# Altium schematic sheet ESP32.SchDoc
size A4; SheetNumber: 1; SheetTotal: 3
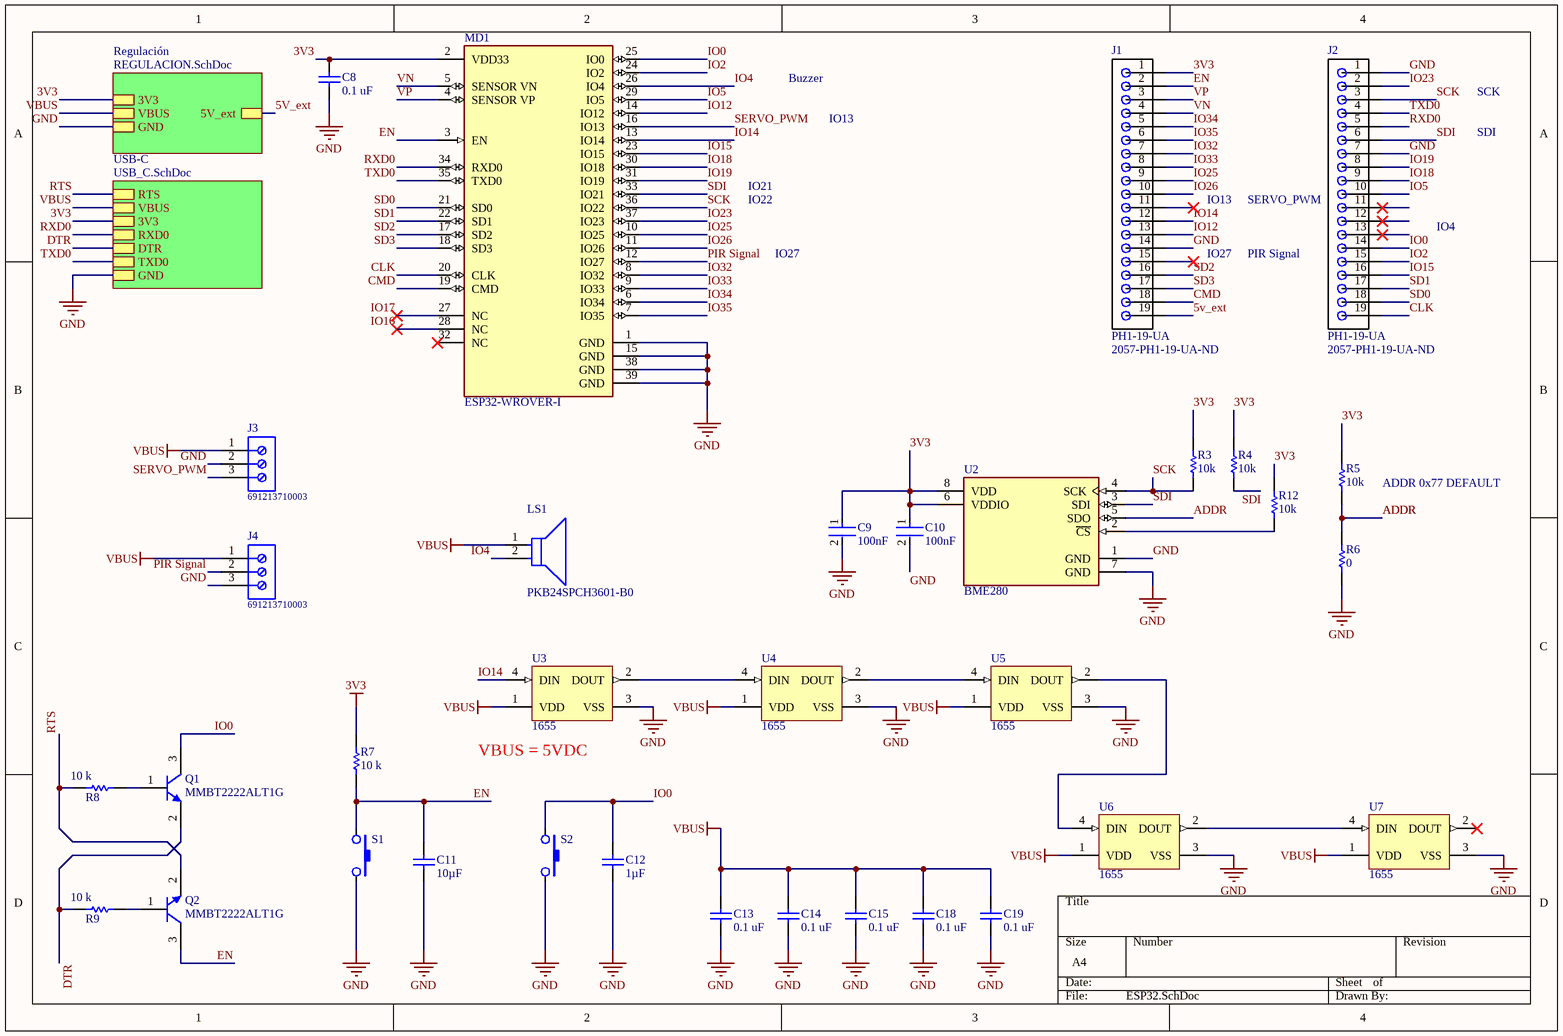
[diagram p0: ESP32.SchDoc]

## Parts
C8  0.1 uF  [CAPC2013X94X50ML20T25]
C9  100nF  [FP-C0805C-DN-MFG]
C10  100nF  [FP-C0805C-DN-MFG]
C11  10µF  [CAPC2013X145X50ML20T25]
C12  1µF  [CAPC2013X145X50ML20T25]
C13  0.1 uF  [CAPC2013X94X50ML20T25]
C14  0.1 uF  [CAPC2013X94X50ML20T25]
C15  0.1 uF  [CAPC2013X94X50ML20T25]
C18  0.1 uF  [CAPC2013X94X50ML20T25]
C19  0.1 uF  [CAPC2013X94X50ML20T25]
J1  PH1-19-UA  Supplier Part Number 1: 2057-PH1-19-UA-ND  [PH1-19-UA]
J2  PH1-19-UA  Supplier Part Number 1: 2057-PH1-19-UA-ND  [PH1-19-UA]
J3  691213710003  [691213710003]
J4  691213710003  [691213710003]
LS1  PKB24SPCH3601-B0  [FP-PKB24SPCH3601-B0-MFG]
MD1  ESP32-WROVER-I  [FP-ESP32-WROVER-I-MFG]
Q1  MMBT2222ALT1G  [ONSC-SOT-23-3-318-08_V]
Q2  MMBT2222ALT1G  [ONSC-SOT-23-3-318-08_V]
R3  10k  [RESC2013X60X40LL20T25_A]
R4  10k  [RESC2013X60X40LL20T25_A]
R5  10k  [RESC2013X60X40LL20T25_A]
R6  0  [RESC2013X60X40LL20T25_A]
R7  10 k  [RESC2013X60X30ML20T20]
R8  10 k  [RESC2013X60X30ML20T20]
R9  10 k  [RESC2013X60X30ML20T20]
R12  10k  [RESC2013X60X40LL20T25_A]
S1  PTS820J25MSMTRLFS  [SMT_SW_PTS_820]  (value not drawn)
S2  IO0  [SMT_SW_PTS_820]  (value not drawn)
U2  BME280  [FP-BME280-MFG]
U3  1655  [ADA-RGB-1655_V]
U4  1655  [ADA-RGB-1655_V]
U5  1655  [ADA-RGB-1655_V]
U6  1655  [ADA-RGB-1655_V]
U7  1655  [ADA-RGB-1655_V]

## Sub-sheets
Regulación = REGULACION.SchDoc: GND, 3V3, VBUS, 5V_ext
USB-C = USB_C.SchDoc: RTS, VBUS, 3V3, RXD0, DTR, TXD0, GND

## Nets
3V3: C8.2 C9.1 C10.1 J1.1 MD1.2(VDD33) R3.2 R4.2 R5.2 R7.2 R12.2 U2.6(VDDIO) U2.8(VDD) ; sheet Regulación/3V3, sheet USB-C/3V3
GND: C8.1 C9.2 C10.2 C11.1 C12.1 C13.1 C14.1 C15.1 C18.1 C19.1 J1.14 J2.1 J2.7 J3.2 J4.3 MD1.1(GND) MD1.15(GND) MD1.38(GND) MD1.39(GND) R6.1 S1.2 S2.2 U2.1(GND) U2.7(GND) U3.3(VSS) U4.3(VSS) U5.3(VSS) U6.3(VSS) U7.3(VSS) ; sheet Regulación/GND, sheet USB-C/GND
VBUS: C13.2 C14.2 C15.2 C18.2 C19.2 J3.1 J4.1 LS1.1(C) U3.1(VDD) U4.1(VDD) U5.1(VDD) U6.1(VDD) U7.1(VDD) ; sheet Regulación/VBUS, sheet USB-C/VBUS
5v_ext: J1.19 ; sheet Regulación/5V_ext
ADDR: R5.1 R6.2 U2.5(SDO)
CLK: J2.19 MD1.20(CLK)
CMD: J1.18 MD1.19(CMD)
DTR: Q1.2(E) R9.2 ; sheet USB-C/DTR
EN: C11.2 J1.2 MD1.3(EN) Q2.3(C) R7.1 S1.1
IO0: C12.2 J2.14 MD1.25(IO0) Q1.3(C) S2.1
IO2: J2.15 MD1.24(IO2)
IO4: LS1.2(A) MD1.26(IO4)
IO5: J2.10 MD1.29(IO5)
IO12: J1.13 MD1.14(IO12)
IO14: J1.12 MD1.13(IO14) U3.4(DIN)
IO15: J2.16 MD1.23(IO15)
IO16: MD1.28(NC)
IO17: MD1.27(NC)
IO18: J2.9 MD1.30(IO18)
IO19: J2.8 MD1.31(IO19)
IO23: J2.2 MD1.37(IO23)
IO25: J1.9 MD1.10(IO25)
IO26: J1.10 MD1.11(IO26)
IO32: J1.7 MD1.8(IO32)
IO33: J1.8 MD1.9(IO33)
IO34: J1.5 MD1.6(IO34)
IO35: J1.6 MD1.7(IO35)
PIR Signal: J4.2 MD1.12(IO27)
RTS: Q2.2(E) R8.2 ; sheet USB-C/RTS
RXD0: J2.5 MD1.34(RXD0) ; sheet USB-C/RXD0
SCK: J2.3 MD1.36(IO22) R3.1 U2.4(SCK)
SD0: J2.18 MD1.21(SD0)
SD1: J2.17 MD1.22(SD1)
SD2: J1.16 MD1.17(SD2)
SD3: J1.17 MD1.18(SD3)
SDI: J2.6 MD1.33(IO21) R4.1 U2.3(SDI)
SERVO_PWM: J3.3 MD1.16(IO13)
TXD0: J2.4 MD1.35(TXD0) ; sheet USB-C/TXD0
VN: J1.4 MD1.5(SENSOR_VN)
VP: J1.3 MD1.4(SENSOR_VP)
NetQ1_1: Q1.1(B) R8.1
NetQ2_1: Q2.1(B) R9.1
NetR12_1: R12.1 U2.2(~{CS})
NetU3_2: U3.2(DOUT) U4.4(DIN)
NetU4_2: U4.2(DOUT) U5.4(DIN)
NetU5_2: U5.2(DOUT) U6.4(DIN)
NetU6_2: U6.2(DOUT) U7.4(DIN)

Not connected (* = marked no-connect by the designer): J1 11* 15*; J2 11* 12* 13*; MD1 32(NC)*; U7 2(DOUT)*

## Notes on the sheet
- Buzzer
- SCK
- IO13
- SDI
- IO22
- IO21
- (near J2) SERVO_PWM
- IO4
- IO27
- (near J2) PIR Signal
- (near R5) ADDR 0x77 DEFAULT
- (near U3) VBUS = 5VDC

## Library data of the parts
C8 C13-C15 C18 C19 = CMP-2000-05016-1: Chip Capacitor, Ceramic, 0.1 uF, 10%, 50 V, 0805, RoHS, Tape and Reel; Manufacturer: AVX; Rated Voltage: 50V; Capacitance: 100nF; Dielectric: X7R; Case Size/Dimension: 0805; Tolerance (%): ±10%; Datasheet URL: http://www.farnell.com/datasheets/319609.pdf; Datasheet Version: Sep-07; Manufacturer URL: http://www.avx.com/
C9 C10 = CMP-2007-00279-2: CAP CER 0.1UF 50V X7R 0805 C0805C104K5RACTU; Manufacturer: KEMET; Value: 0.10 μF; Tolerance: 0.1; Temperature Coefficient: 30ppm/°C; Material: Ceramic; Manufacturer Part Number: C0805C104K5RACTU; Device Class L2: Capacitors; Temperature Range Low: -55°C; Voltage Rating: 50 V; Digikey Description: CAP CER 0.1UF 50V X7R 0805; Category: Cap; ComponentLink2Description: Datasheet; Octopart: https://octopart.com/c0805c104k5ractu-kemet-143926; RoHS: TRUE; ComponentLink2URL: https://content.kemet.com/datasheets/KEM_C1003_C0G_SMD.pdf; Temperature Characteristic: X7R; Temperature: -55°C to +125°C; Height: 0.88mm; Temperature Range High: +125°C; Device Class L1: Passive Components; Automotive: No; Lead Free: Yes; Ipc Land Pattern Name: CAPC200125X78; Device Class L3: Ceramic Capacitors; Mouser Description: Cap Ceramic 0.1uF 50V X7R 10% SMD 2.0 x 1.2 mm 125 C Paper T/R; Capacitance: 0.10 μF; Package: C0805C-DN
C11 C12 = CMP-2007-01082-1: 1µF ±10% 16V Ceramic Capacitor X7R 0805 (2012 Metric); Manufacturer: Kemet; Part Number: C0805C105K4RAC7800
J1 J2 = PH1-19-UA: Connector Header Through Hole 19 position 0.100" (2.54mm); Supplier 1: Digi-Key
J3 J4 = CMP-1502-02527-1: Serie 213 - 5.00 mm Horizontal Entry Modular with RisingCage Clamp WR-TBL, 3 pin; Manufacturer: Wurth Elektronik; Pin Number: 3; Pitch: 5.00mm; Manufacturer URL: http://www.we-online.de; Mounting Technology: THT; Packaging: Box; Datasheet URL: http://katalog.we-online.de/em/datasheet/6912137100xx.pdf; Operating Temperature: -40to105degC; Part Number: 691213710003; Package Reference: 691213710003; Publisher: WurthElektronik
LS1 = CMP-06203-000001-2: AUDIO PIEZO TRANSDUCER 3-15V TH; Self Resonant Frequency: 3.6kHz; Voltage Rating (DC): 15V; Min Supply Voltage: 3V; Operating Supply Current: 16mA; Voltage Rating: 12V; Max Frequency: 4.1kHz; Washable: No; REACH SVHC: No SVHC; Packaging: Bulk; Frequency: 3.6kHz; Max Operating Temperature: 70°C; Max Supply Voltage: 15V; Max Supply Voltage (DC): 15V; Diameter: 24.3mm; Lead Free: Lead Free; Radiation Hardening: No; Nominal Supply Current: 16mA; Height: 9.7mm; Mount: Flush; Nominal Supply Voltage (DC): 12V; Min Operating Temperature: -20°C; Termination: PC Pins; Length: 24.3mm; Package Quantity: 650; Min Supply Voltage (DC): 3V; Max Supply Current: 16mA
MD1 = CMP-194065-000001-1: SMD MODULE, ESP32-D0WDQ6, 32MBIT; Manufacturer: Espressif; Number Of Adc Channels: 16; Min Supply Voltage: 2.3V; Interface: I2C,SPI,UART,I2S,Other; Max Frequency: 2484MHz; Nominal Supply Current: 500mA; Sensitivity: -98dBm; Max Supply Voltage: 3.6V; Number Of Gpio: 20; Data Rate: 150Mbits/s; Package: ESP32-WROVER-I; Temperature Range Low: -40°C; Temperature Range High: +85°C; Device Class L1: Integrated Circuits (ICs); Category: UNK; ComponentLink2Description: Datasheet; Device Class L2: RF Semiconductors and Devices; Automotive: No; Lead Free: Yes; Octopart: https://octopart.com/esp32-wrover-i-espressif+systems-89171349; ComponentLink2URL: https://www.espressif.com/sites/default/files/documentation/esp32-wrover_datasheet_en.pdf; Temperature: -40°C to +85°C; Height: 3.4mm; RoHS: TRUE; Digikey Description: SMD MODULE, ESP32-D0WDQ6, 32MBIT; Device Class L3: Transceivers; Manufacturer Part Number: ESP32-WROVER-I
Q1 Q2 = CMP-1048-00538-1: General Purpose Transistor, NPN Silicon, 3-Pin SOT-23, Pb-Free, Tape and Reel; Manufacturer: On Semiconductor; fT Min (MHz): 300; IC Continuous (A): 0.6; ComponentLink3URL: http://www.onsemi.cn/pub_link/Collateral/318-08.PDF; PartNumber: MMBT2222ALT1G; RoHS: TRUE; ComponentLink1URL: http://www.onsemi.com/; ComponentLink3Description: Package Specification; ComponentLink2Description: Datasheet; Mounting Technology: Surface Mount; Packing: Tape and Reel; PackageDescription: 3-Pin Small Outline Transistor, Body 2.92 x 1.3 mm, Pitch 0.95 mm; DatasheetVersion: Rev. 10; PackageReference: SOT-23-3-318-08; ComponentLink2URL: http://www.onsemi.cn/pub_link/Collateral/MMBT2222LT1-D.PDF; Polarity: NPN; PackageVersion: Rev. AP, 11/2009; ComponentLink1Description: Manufacturer URL
R3-R6 R12 = CMP-2001-00582-2: Metal Film Chip Resistor, High Reliability Type, 0.125 W, +/- 0.1%, -55 to 155 degC, 0805 (2012 Metric), RoHS, Tape and Reel; Voltage Rating: 100V; Power Rating: 125mW(1/8W); Brand: Panasonic; Temperature Coefficient: 25PPM/C; Resistance: 10kOhms; Product Category: ThinFilmResistors-SMD; Datasheet Version: 02/2016; Operating Temperature Range: -55Cto+155C; Length: 2mm; Mounting Technology: SurfaceMount; Manufacturer URL: http://www.panasonic.com/; Width: 1.25mm; Packaging: Reel; Product: ThinFilmResistorsSMD; Package / Case: 0805(2012metric); Termination Style: SMD/SMT; Tolerance: 0.1%; Datasheet URL: https://industrial.panasonic.com/cdbs/www-data/pdf/RDM0000/AOA0000C307.pdf; Package Description: 2-Pin Surface Mount Device, Body 2 x 1.25 mm; Factory Pack Quantity: 5000; Series: ERA-6A; Case Code - mm: 2012; RoHS: Details; Package Reference: 0805; Height: 0.5mm; Manufacturer: Panasonic; Case Code - in: 0805; Type: MetalFilmChipResistors
R7-R9 = CMP-2001-04657-1: 10 kOhms ±5% 0.25W, 1/4W Chip Resistor 0805 (2012 Metric) Automotive AEC-Q200, Moisture Resistant Thick Film; Part Number: RK73B2ATTD103J; Manufacturer: KOA Speer
S2 = PTS820J25MSMTRLFS
U2 = CMP-2000-05073-3: SENSOR PRESSURE HUMIDITY TEMP; Sensor Type: Temperature; Accuracy: 3%; Response Time: 1s; Output Type: SPI; Min Operating Temperature: -40°C; Max Operating Temperature: 85°C; Case/Package: LGA; Packaging: Cut Tape; Mount: Surface Mount; Lead Free: Lead Free; Number of Pins: 8
U3-U7 = CMP-2000-05026-1: Intelligent Control LED Integrated Light Source, 3.5 to 5.3 V, -25 to 80 degC, 4-Pin SMD, RoHS, Tape and Reel; Manufacturer: Adafruit-Industries-LLC; Number of LEDs: 10; Configuration: Discrete; Utilized LED: WS2812(5050); Datasheet URL: http://datasheet.octopart.com/ADA1655-Adafruit-Industries-datasheet-32028139.pdf; Series: Neopixel; Interface: -; Package Description: 4-Pin Surface Mount Device, Body 5 x 5 mm; Color: Red,Green,Blue(RGB); Category: Optoelectronics; Controller Type: -; Package Reference: 1655; Manufacturer URL: https://www.adafruit.com/; Mounting Type: SurfaceMount; Datasheet Version: May-13; Size / Dimension: 5.00mmLx5.00mmW; Family: Addressable,Specialty